# Altium schematic sheet 凌霄核心板插座原理图.SchDoc
size A4
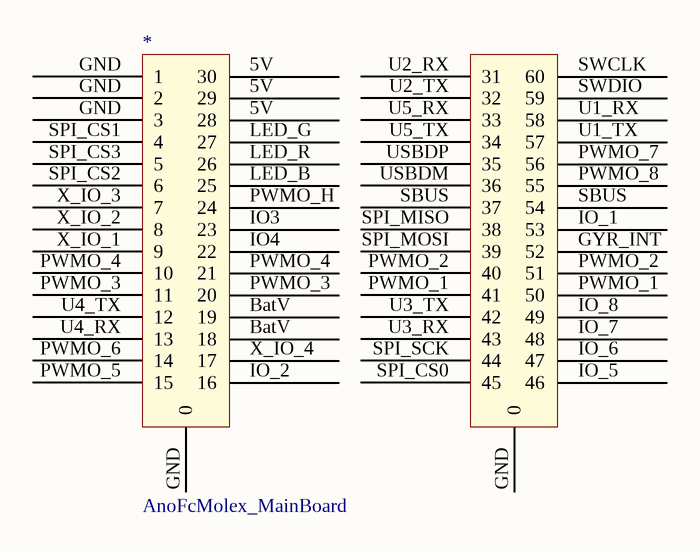
[diagram p0: 凌霄核心板插座原理图.SchDoc]

## Parts
*  AnoFcMolex_MainBoard  [AnoFcMolex_MainBoard]

## Nets

Not connected (* = marked no-connect by the designer): * 5V(28) BatV(18) GND(1) GYR_INT(52) IO3(23) IO4(22) IO_1(53) IO_2(16) IO_5(46) IO_6(47) IO_7(48) IO_8(49) LED_B(25) LED_G(27) LED_R(26) PWMO_1(41) PWMO_2(40) PWMO_3(11) PWMO_4(10) PWMO_5(15) PWMO_6(14) PWMO_7(56) PWMO_8(55) PWMO_H(24) SBUS(37) SPI_CS0(45) SPI_CS1(4) SPI_CS2(6) SPI_CS3(5) SPI_MISO(38) SPI_MOSI(39) SPI_SCK(44) SWCLK(60) SWDIO(59) U1_RX(58) U1_TX(57) U2_RX(31) U2_TX(32) U3_RX(43) U3_TX(42) U4_RX(13) U4_TX(12) U5_RX(33) U5_TX(34) USBDM(36) USBDP(35) X_IO_1(9) X_IO_2(8) X_IO_3(7) X_IO_4(17)